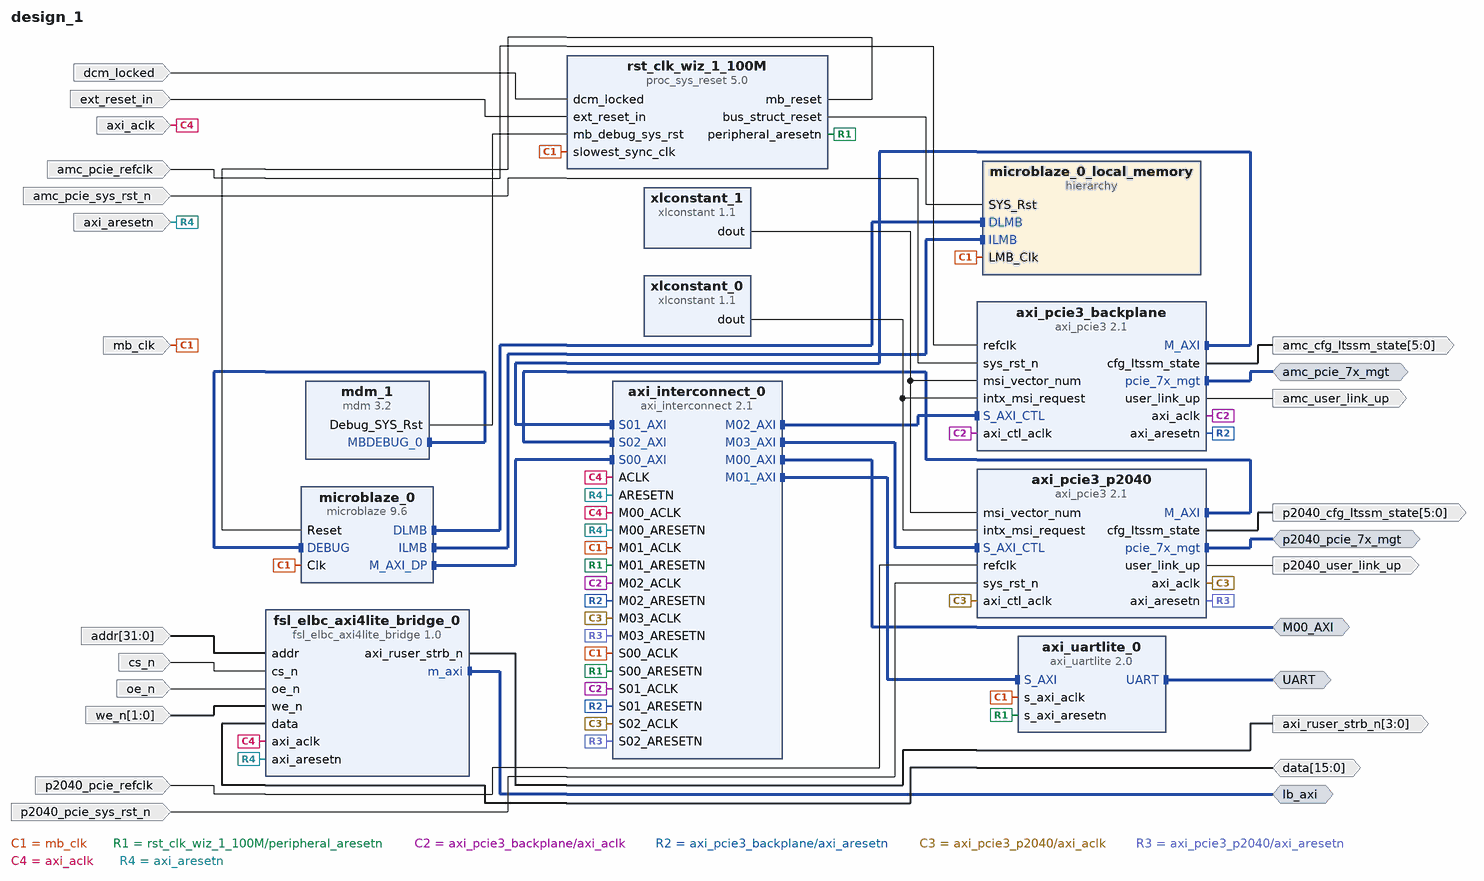
[diagram p0: block diagram of the top level]
# Vivado block design design_1, Vivado 2016.1
create_bd_design design_1

create_bd_intf_port -mode Master -vlnv xilinx.com:interface:aximm_rtl:1.0 M00_AXI
set_property -dict [list \
  CONFIG.DATA_WIDTH 32 \
  CONFIG.PROTOCOL AXI4LITE \
  CONFIG.FREQ_HZ 156250000 \
  CONFIG.ADDR_WIDTH 32 \
  CONFIG.NUM_READ_OUTSTANDING 2 \
  CONFIG.NUM_WRITE_OUTSTANDING 2 \
] [get_bd_intf_ports M00_AXI]
create_bd_intf_port -mode Master -vlnv xilinx.com:interface:uart_rtl:1.0 UART
create_bd_intf_port -mode Master -vlnv xilinx.com:interface:pcie_7x_mgt_rtl:1.0 amc_pcie_7x_mgt
create_bd_intf_port -mode Master -vlnv xilinx.com:interface:pcie_7x_mgt_rtl:1.0 p2040_pcie_7x_mgt
create_bd_intf_port -mode Master -vlnv xilinx.com:interface:aximm_rtl:1.0 lb_axi
set_property -dict [list \
  CONFIG.DATA_WIDTH 32 \
  CONFIG.PROTOCOL AXI4LITE \
  CONFIG.FREQ_HZ 156250000 \
  CONFIG.ADDR_WIDTH 32 \
  CONFIG.HAS_BURST 0 \
  CONFIG.HAS_LOCK 0 \
  CONFIG.HAS_CACHE 0 \
  CONFIG.HAS_QOS 0 \
  CONFIG.HAS_REGION 0 \
] [get_bd_intf_ports lb_axi]
create_bd_port -dir I -type clk mb_clk
set_property -dict {CONFIG.FREQ_HZ 100000000 CONFIG.ASSOCIATED_RESET ext_reset_in} [get_bd_ports mb_clk]
create_bd_port -dir I dcm_locked
create_bd_port -dir I -type rst ext_reset_in
set_property -dict {CONFIG.POLARITY ACTIVE_HIGH} [get_bd_ports ext_reset_in]
create_bd_port -dir I -type clk amc_pcie_refclk
create_bd_port -dir I -type rst amc_pcie_sys_rst_n
create_bd_port -dir I -type clk p2040_pcie_refclk
create_bd_port -dir I -type rst p2040_pcie_sys_rst_n
create_bd_port -dir O -from 5 -to 0 amc_cfg_ltssm_state
create_bd_port -dir O amc_user_link_up
create_bd_port -dir O -from 5 -to 0 p2040_cfg_ltssm_state
create_bd_port -dir O p2040_user_link_up
create_bd_port -dir I -type clk axi_aclk
set_property -dict {CONFIG.FREQ_HZ 156250000 CONFIG.ASSOCIATED_BUSIF M00_AXI:lb_axi} [get_bd_ports axi_aclk]
create_bd_port -dir I -type rst axi_aresetn
create_bd_port -dir O -from 3 -to 0 axi_ruser_strb_n
create_bd_port -dir I -from 31 -to 0 addr
create_bd_port -dir I cs_n
create_bd_port -dir I oe_n
create_bd_port -dir I -from 1 -to 0 we_n
create_bd_port -dir IO -from 15 -to 0 data

create_bd_cell -type hier microblaze_0_local_memory
create_bd_cell -type ip -vlnv xilinx.com:ip:xlconstant:1.1 xlconstant_0
set_property -dict {CONFIG.CONST_VAL 0} [get_bd_cells xlconstant_0]
create_bd_cell -type ip -vlnv xilinx.com:ip:xlconstant:1.1 xlconstant_1
set_property -dict {CONFIG.CONST_WIDTH 5 CONFIG.CONST_VAL 0} [get_bd_cells xlconstant_1]
create_bd_cell -type ip -vlnv vadatech.com:user:fsl_elbc_axi4lite_bridge:1.0 fsl_elbc_axi4lite_bridge_0
set_property -dict {CONFIG.BARSIZE 16} [get_bd_cells fsl_elbc_axi4lite_bridge_0]
create_bd_cell -type ip -vlnv xilinx.com:ip:axi_interconnect:2.1 axi_interconnect_0
set_property -dict {CONFIG.NUM_SI 3 CONFIG.NUM_MI 4} [get_bd_cells axi_interconnect_0]
create_bd_cell -type ip -vlnv xilinx.com:ip:axi_pcie3:2.1 axi_pcie3_backplane
set_property -dict [list \
  CONFIG.pl_link_cap_max_link_width X8 \
  CONFIG.pl_link_cap_max_link_speed 8.0_GT/s \
  CONFIG.axi_data_width 256_bit \
  CONFIG.axisten_freq 250 \
  CONFIG.en_axi_slave_if false \
  CONFIG.vendor_id ABCD \
  CONFIG.pf0_device_id 4516 \
  CONFIG.pf0_subsystem_vendor_id ABCD \
  CONFIG.pf0_subsystem_id F228 \
  CONFIG.pf0_class_code_base FF \
  CONFIG.pf0_class_code_sub FF \
  CONFIG.pf0_bar0_size 64 \
  CONFIG.pciebar2axibar_0 0x000000044a00000 \
] [get_bd_cells axi_pcie3_backplane]
create_bd_cell -type ip -vlnv xilinx.com:ip:axi_pcie3:2.1 axi_pcie3_p2040
set_property -dict [list \
  CONFIG.pcie_blk_locn X0Y1 \
  CONFIG.pl_link_cap_max_link_width X2 \
  CONFIG.pl_link_cap_max_link_speed 5.0_GT/s \
  CONFIG.plltype QPLL1 \
  CONFIG.axisten_freq 125 \
  CONFIG.en_axi_slave_if false \
  CONFIG.vendor_id ABCD \
  CONFIG.pf0_device_id 5516 \
  CONFIG.pf0_subsystem_vendor_id ABCD \
  CONFIG.pf0_subsystem_id 5516 \
  CONFIG.pf0_class_code_base FF \
  CONFIG.pf0_class_code_sub FF \
  CONFIG.pf0_bar0_size 64 \
  CONFIG.pciebar2axibar_0 0x0000000044a00000 \
] [get_bd_cells axi_pcie3_p2040]
create_bd_cell -type ip -vlnv xilinx.com:ip:axi_uartlite:2.0 axi_uartlite_0
set_property -dict {CONFIG.C_BAUDRATE 115200} [get_bd_cells axi_uartlite_0]
create_bd_cell -type ip -vlnv xilinx.com:ip:mdm:3.2 mdm_1
create_bd_cell -type ip -vlnv xilinx.com:ip:microblaze:9.6 microblaze_0
set_property -dict [list \
  CONFIG.C_D_AXI 1 \
  CONFIG.C_D_LMB 1 \
  CONFIG.C_I_LMB 1 \
  CONFIG.G_USE_EXCEPTIONS 1 \
  CONFIG.C_USE_MSR_INSTR 1 \
  CONFIG.C_USE_PCMP_INSTR 1 \
  CONFIG.C_USE_BARREL 1 \
  CONFIG.C_DEBUG_ENABLED 1 \
] [get_bd_cells microblaze_0]
create_bd_cell -type ip -vlnv xilinx.com:ip:proc_sys_reset:5.0 rst_clk_wiz_1_100M

# ---- hierarchy /microblaze_0_local_memory ----
current_bd_instance /microblaze_0_local_memory
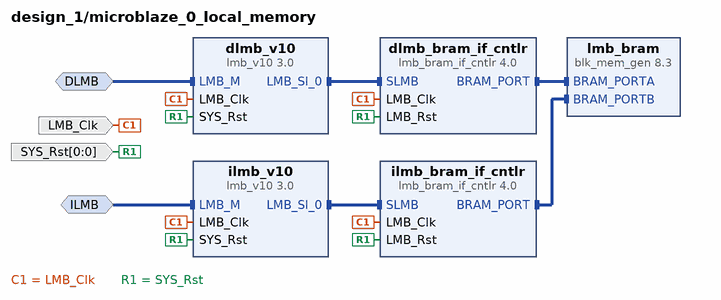
[diagram p1: block diagram inside /microblaze_0_local_memory]
create_bd_intf_pin -mode MirroredMaster -vlnv xilinx.com:interface:lmb_rtl:1.0 DLMB
create_bd_intf_pin -mode MirroredMaster -vlnv xilinx.com:interface:lmb_rtl:1.0 ILMB
create_bd_pin -dir I -type clk LMB_Clk
create_bd_pin -dir I -from 0 -to 0 -type rst SYS_Rst

create_bd_cell -type ip -vlnv xilinx.com:ip:lmb_bram_if_cntlr:4.0 dlmb_bram_if_cntlr
set_property -dict {CONFIG.C_ECC 0} [get_bd_cells dlmb_bram_if_cntlr]
create_bd_cell -type ip -vlnv xilinx.com:ip:lmb_v10:3.0 dlmb_v10
create_bd_cell -type ip -vlnv xilinx.com:ip:lmb_bram_if_cntlr:4.0 ilmb_bram_if_cntlr
set_property -dict {CONFIG.C_ECC 0} [get_bd_cells ilmb_bram_if_cntlr]
create_bd_cell -type ip -vlnv xilinx.com:ip:lmb_v10:3.0 ilmb_v10
create_bd_cell -type ip -vlnv xilinx.com:ip:blk_mem_gen:8.3 lmb_bram
set_property -dict {CONFIG.Memory_Type True_Dual_Port_RAM CONFIG.use_bram_block BRAM_Controller} [get_bd_cells lmb_bram]

# ---- connections ----

current_bd_instance /microblaze_0_local_memory
connect_bd_intf_net -intf_net microblaze_0_dlmb_bus [get_bd_intf_pins dlmb_v10/LMB_Sl_0] [get_bd_intf_pins dlmb_bram_if_cntlr/SLMB]
connect_bd_intf_net -intf_net microblaze_0_ilmb_bus [get_bd_intf_pins ilmb_v10/LMB_Sl_0] [get_bd_intf_pins ilmb_bram_if_cntlr/SLMB]
connect_bd_intf_net -intf_net microblaze_0_dlmb_cntlr [get_bd_intf_pins dlmb_bram_if_cntlr/BRAM_PORT] [get_bd_intf_pins lmb_bram/BRAM_PORTA]
connect_bd_intf_net -intf_net microblaze_0_ilmb_cntlr [get_bd_intf_pins ilmb_bram_if_cntlr/BRAM_PORT] [get_bd_intf_pins lmb_bram/BRAM_PORTB]
connect_bd_intf_net -intf_net microblaze_0_dlmb [get_bd_intf_pins DLMB] [get_bd_intf_pins dlmb_v10/LMB_M]
connect_bd_intf_net -intf_net microblaze_0_ilmb [get_bd_intf_pins ILMB] [get_bd_intf_pins ilmb_v10/LMB_M]
connect_bd_net -net microblaze_0_Clk [get_bd_pins LMB_Clk] \
  [get_bd_pins dlmb_bram_if_cntlr/LMB_Clk] [get_bd_pins dlmb_v10/LMB_Clk] [get_bd_pins ilmb_bram_if_cntlr/LMB_Clk] \
  [get_bd_pins ilmb_v10/LMB_Clk]
connect_bd_net [get_bd_pins SYS_Rst] \
  [get_bd_pins dlmb_bram_if_cntlr/LMB_Rst] [get_bd_pins dlmb_v10/SYS_Rst] [get_bd_pins ilmb_bram_if_cntlr/LMB_Rst] \
  [get_bd_pins ilmb_v10/SYS_Rst]

current_bd_instance /
connect_bd_intf_net [get_bd_intf_pins microblaze_0/DLMB] [get_bd_intf_pins microblaze_0_local_memory/DLMB]
connect_bd_intf_net [get_bd_intf_pins microblaze_0/ILMB] [get_bd_intf_pins microblaze_0_local_memory/ILMB]
connect_bd_intf_net [get_bd_intf_pins mdm_1/MBDEBUG_0] [get_bd_intf_pins microblaze_0/DEBUG]
connect_bd_intf_net [get_bd_intf_pins microblaze_0/M_AXI_DP] [get_bd_intf_pins axi_interconnect_0/S00_AXI]
connect_bd_intf_net [get_bd_intf_pins axi_uartlite_0/S_AXI] [get_bd_intf_pins axi_interconnect_0/M01_AXI]
connect_bd_intf_net [get_bd_intf_pins axi_interconnect_0/M02_AXI] [get_bd_intf_pins axi_pcie3_backplane/S_AXI_CTL]
connect_bd_intf_net [get_bd_intf_pins axi_pcie3_backplane/M_AXI] [get_bd_intf_pins axi_interconnect_0/S01_AXI]
connect_bd_intf_net [get_bd_intf_pins axi_interconnect_0/M03_AXI] [get_bd_intf_pins axi_pcie3_p2040/S_AXI_CTL]
connect_bd_intf_net [get_bd_intf_pins axi_pcie3_p2040/M_AXI] [get_bd_intf_pins axi_interconnect_0/S02_AXI]
connect_bd_intf_net [get_bd_intf_ports M00_AXI] [get_bd_intf_pins axi_interconnect_0/M00_AXI]
connect_bd_intf_net [get_bd_intf_ports UART] [get_bd_intf_pins axi_uartlite_0/UART]
connect_bd_intf_net [get_bd_intf_ports amc_pcie_7x_mgt] [get_bd_intf_pins axi_pcie3_backplane/pcie_7x_mgt]
connect_bd_intf_net [get_bd_intf_ports p2040_pcie_7x_mgt] [get_bd_intf_pins axi_pcie3_p2040/pcie_7x_mgt]
connect_bd_intf_net [get_bd_intf_ports lb_axi] [get_bd_intf_pins fsl_elbc_axi4lite_bridge_0/m_axi]
connect_bd_net -net microblaze_0_Clk [get_bd_ports mb_clk] \
  [get_bd_pins microblaze_0_local_memory/LMB_Clk] [get_bd_pins axi_interconnect_0/S00_ACLK] \
  [get_bd_pins axi_interconnect_0/M01_ACLK] [get_bd_pins axi_uartlite_0/s_axi_aclk] [get_bd_pins microblaze_0/Clk] \
  [get_bd_pins rst_clk_wiz_1_100M/slowest_sync_clk]
connect_bd_net [get_bd_pins rst_clk_wiz_1_100M/mb_reset] [get_bd_pins microblaze_0/Reset]
connect_bd_net [get_bd_pins rst_clk_wiz_1_100M/bus_struct_reset] [get_bd_pins microblaze_0_local_memory/SYS_Rst]
connect_bd_net [get_bd_pins mdm_1/Debug_SYS_Rst] [get_bd_pins rst_clk_wiz_1_100M/mb_debug_sys_rst]
connect_bd_net [get_bd_ports dcm_locked] [get_bd_pins rst_clk_wiz_1_100M/dcm_locked]
connect_bd_net [get_bd_ports ext_reset_in] [get_bd_pins rst_clk_wiz_1_100M/ext_reset_in]
connect_bd_net [get_bd_pins rst_clk_wiz_1_100M/peripheral_aresetn] \
  [get_bd_pins axi_interconnect_0/S00_ARESETN] [get_bd_pins axi_interconnect_0/M01_ARESETN] \
  [get_bd_pins axi_uartlite_0/s_axi_aresetn]
connect_bd_net [get_bd_pins xlconstant_1/dout] [get_bd_pins axi_pcie3_backplane/msi_vector_num] [get_bd_pins axi_pcie3_p2040/msi_vector_num]
connect_bd_net -net refclk_1 [get_bd_ports amc_pcie_refclk] [get_bd_pins axi_pcie3_backplane/refclk]
connect_bd_net [get_bd_pins xlconstant_0/dout] [get_bd_pins axi_pcie3_backplane/intx_msi_request] [get_bd_pins axi_pcie3_p2040/intx_msi_request]
connect_bd_net -net sys_rst_n_1 [get_bd_ports amc_pcie_sys_rst_n] [get_bd_pins axi_pcie3_backplane/sys_rst_n]
connect_bd_net -net refclk_2 [get_bd_ports p2040_pcie_refclk] [get_bd_pins axi_pcie3_p2040/refclk]
connect_bd_net -net sys_rst_n_2 [get_bd_ports p2040_pcie_sys_rst_n] [get_bd_pins axi_pcie3_p2040/sys_rst_n]
connect_bd_net [get_bd_pins axi_pcie3_backplane/cfg_ltssm_state] [get_bd_ports amc_cfg_ltssm_state]
connect_bd_net [get_bd_pins axi_pcie3_backplane/user_link_up] [get_bd_ports amc_user_link_up]
connect_bd_net [get_bd_pins axi_pcie3_backplane/axi_aclk] \
  [get_bd_pins axi_interconnect_0/S01_ACLK] [get_bd_pins axi_interconnect_0/M02_ACLK] \
  [get_bd_pins axi_pcie3_backplane/axi_ctl_aclk]
connect_bd_net -net S01_ARESETN_1 [get_bd_pins axi_pcie3_backplane/axi_aresetn] \
  [get_bd_pins axi_interconnect_0/S01_ARESETN] [get_bd_pins axi_interconnect_0/M02_ARESETN]
connect_bd_net [get_bd_pins axi_pcie3_p2040/axi_aclk] \
  [get_bd_pins axi_interconnect_0/S02_ACLK] [get_bd_pins axi_interconnect_0/M03_ACLK] \
  [get_bd_pins axi_pcie3_p2040/axi_ctl_aclk]
connect_bd_net -net S02_ARESETN_1 [get_bd_pins axi_pcie3_p2040/axi_aresetn] \
  [get_bd_pins axi_interconnect_0/S02_ARESETN] [get_bd_pins axi_interconnect_0/M03_ARESETN]
connect_bd_net [get_bd_pins axi_pcie3_p2040/cfg_ltssm_state] [get_bd_ports p2040_cfg_ltssm_state]
connect_bd_net [get_bd_pins axi_pcie3_p2040/user_link_up] [get_bd_ports p2040_user_link_up]
connect_bd_net -net S03_ACLK_1 [get_bd_ports axi_aclk] \
  [get_bd_pins fsl_elbc_axi4lite_bridge_0/axi_aclk] [get_bd_pins axi_interconnect_0/ACLK] \
  [get_bd_pins axi_interconnect_0/M00_ACLK]
connect_bd_net -net S03_ARESETN_1 [get_bd_ports axi_aresetn] \
  [get_bd_pins fsl_elbc_axi4lite_bridge_0/axi_aresetn] [get_bd_pins axi_interconnect_0/ARESETN] \
  [get_bd_pins axi_interconnect_0/M00_ARESETN]
connect_bd_net [get_bd_pins fsl_elbc_axi4lite_bridge_0/axi_ruser_strb_n] [get_bd_ports axi_ruser_strb_n]
connect_bd_net [get_bd_ports addr] [get_bd_pins fsl_elbc_axi4lite_bridge_0/addr]
connect_bd_net [get_bd_ports cs_n] [get_bd_pins fsl_elbc_axi4lite_bridge_0/cs_n]
connect_bd_net [get_bd_ports oe_n] [get_bd_pins fsl_elbc_axi4lite_bridge_0/oe_n]
connect_bd_net [get_bd_ports we_n] [get_bd_pins fsl_elbc_axi4lite_bridge_0/we_n]
connect_bd_net [get_bd_ports data] [get_bd_pins fsl_elbc_axi4lite_bridge_0/data]

# ---- address map ----
assign_bd_address -offset 0x20000000 -range 64K -target_address_space [get_bd_addr_spaces axi_pcie3_backplane/M_AXI] [get_bd_addr_segs axi_pcie3_backplane/S_AXI_CTL/CTL0]
assign_bd_address -offset 0x44A00000 -range 64K -target_address_space [get_bd_addr_spaces axi_pcie3_backplane/M_AXI] [get_bd_addr_segs M00_AXI/Reg]
exclude_bd_addr_seg -offset 0x10000000 -range 64K -target_address_space [get_bd_addr_spaces axi_pcie3_backplane/M_AXI] [get_bd_addr_segs axi_pcie3_p2040/S_AXI_CTL/CTL0]
exclude_bd_addr_seg -offset 0x40600000 -range 64K -target_address_space [get_bd_addr_spaces axi_pcie3_backplane/M_AXI] [get_bd_addr_segs axi_uartlite_0/S_AXI/Reg]
assign_bd_address -offset 0x10000000 -range 64K -target_address_space [get_bd_addr_spaces axi_pcie3_p2040/M_AXI] [get_bd_addr_segs axi_pcie3_p2040/S_AXI_CTL/CTL0]
assign_bd_address -offset 0x44A00000 -range 64K -target_address_space [get_bd_addr_spaces axi_pcie3_p2040/M_AXI] [get_bd_addr_segs M00_AXI/Reg]
exclude_bd_addr_seg -offset 0x20000000 -range 64K -target_address_space [get_bd_addr_spaces axi_pcie3_p2040/M_AXI] [get_bd_addr_segs axi_pcie3_backplane/S_AXI_CTL/CTL0]
exclude_bd_addr_seg -offset 0x40600000 -range 64K -target_address_space [get_bd_addr_spaces axi_pcie3_p2040/M_AXI] [get_bd_addr_segs axi_uartlite_0/S_AXI/Reg]
assign_bd_address -offset 0x00000000 -range 64K -target_address_space [get_bd_addr_spaces fsl_elbc_axi4lite_bridge_0/m_axi] [get_bd_addr_segs lb_axi/Reg]
assign_bd_address -offset 0x00000000 -range 256K -target_address_space [get_bd_addr_spaces microblaze_0/Data] [get_bd_addr_segs microblaze_0_local_memory/dlmb_bram_if_cntlr/SLMB/Mem]
assign_bd_address -offset 0x40600000 -range 64K -target_address_space [get_bd_addr_spaces microblaze_0/Data] [get_bd_addr_segs axi_uartlite_0/S_AXI/Reg]
assign_bd_address -offset 0x44A00000 -range 64K -target_address_space [get_bd_addr_spaces microblaze_0/Data] [get_bd_addr_segs M00_AXI/Reg]
exclude_bd_addr_seg -offset 0x10000000 -range 64K -target_address_space [get_bd_addr_spaces microblaze_0/Data] [get_bd_addr_segs axi_pcie3_p2040/S_AXI_CTL/CTL0]
exclude_bd_addr_seg -offset 0x20000000 -range 64K -target_address_space [get_bd_addr_spaces microblaze_0/Data] [get_bd_addr_segs axi_pcie3_backplane/S_AXI_CTL/CTL0]
assign_bd_address -offset 0x00000000 -range 256K -target_address_space [get_bd_addr_spaces microblaze_0/Instruction] [get_bd_addr_segs microblaze_0_local_memory/ilmb_bram_if_cntlr/SLMB/Mem]

validate_bd_design
save_bd_design
